# Altium schematic sheet [02] BLOCK DIAGRAM.SchDoc: Template
size A4; Author: Hom; CompanyName: KitSprout; DrawnBy: Hom; Engineer: Hom; Organization: KitSprout; Revision: A; SheetNumber: 2; SheetTotal: 6; Version: 0.0; LibVersion: 0.0
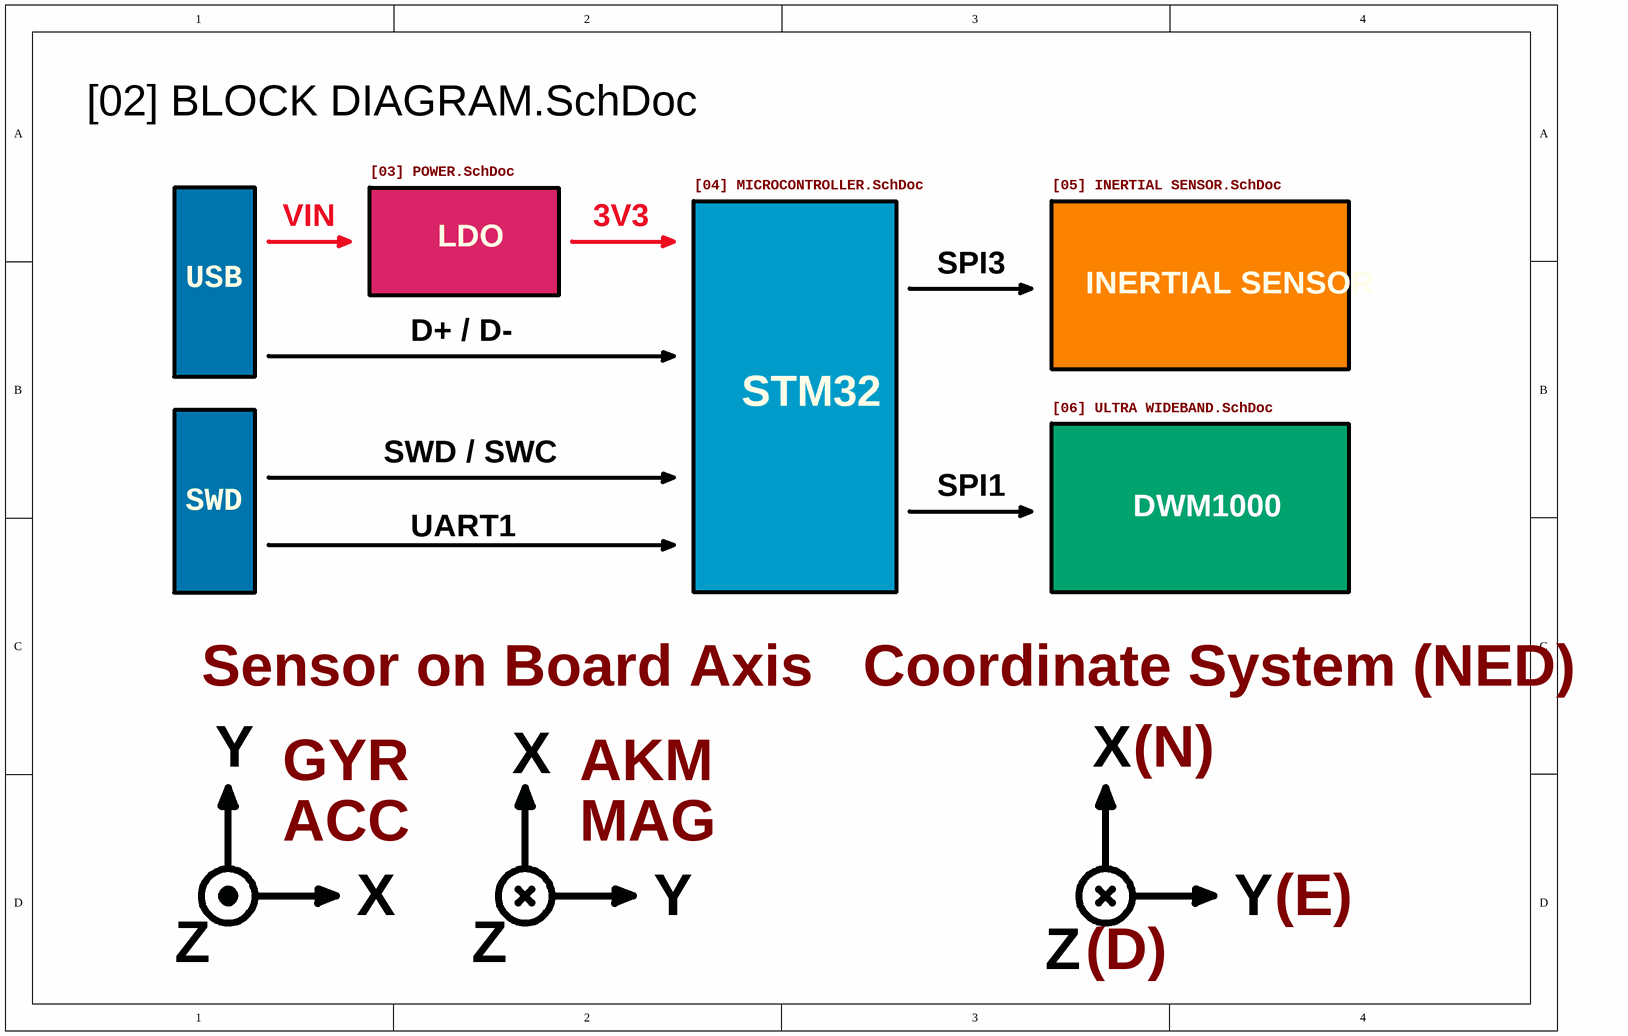
[diagram p0: [02] BLOCK DIAGRAM.SchDoc]

## Sub-sheets
DWM1000 = [06] ULTRA WIDEBAND.SchDoc: no entries
INERTIAL SENSOR = [05] INERTIAL SENSOR.SchDoc: no entries
LDO = [03] POWER.SchDoc: no entries
STM32 = [04] MICROCONTROLLER.SchDoc: no entries

## Notes on the sheet
- VIN
- 3V3
- SPI3
- USB
- D+ / D-
- SWD / SWC
- SPI1
- UART1
- SWD
- Sensor on Board Axis
- Coordinate System (NED)
- Y
- GYR
- X
- AKM
- (N)
- ACC
- MAG
- (E)
- Z
- (D)